# EAGLE design SCFschem (EAGLE 8.7.1)
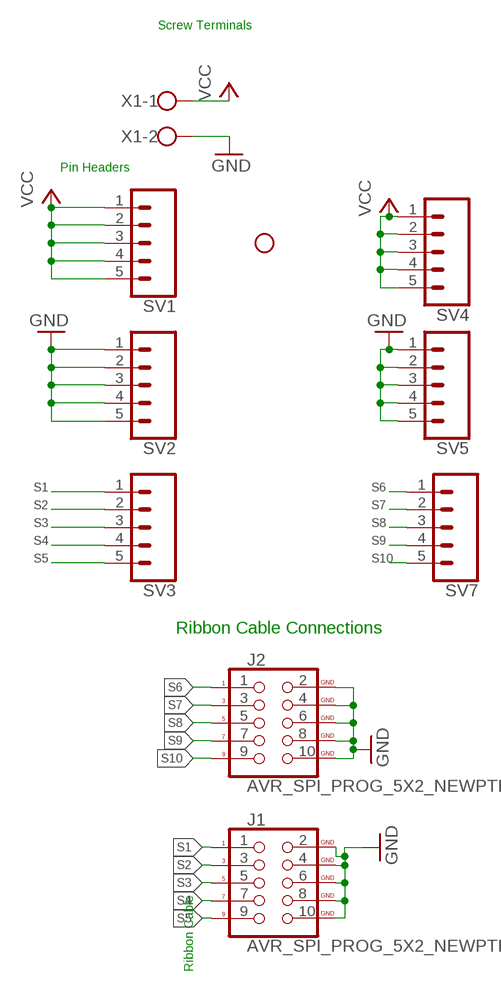
[diagram p0: schematic, sheet 1]

## Parts
H1  STAND-OFF  [STAND-OFF]
J1  AVR_SPI_PROG_5X2_NEWPTH2  [2X5-SHROUDED]
J2  AVR_SPI_PROG_5X2_NEWPTH2  [2X5-SHROUDED]
SV1  CONN_05  [1X05]
SV2  CONN_05  [1X05]
SV3  CONN_05  [1X05]
SV4  CONN_05  [1X05]
SV5  CONN_05  [1X05]
SV7  CONN_05  [1X05]
X1  1X02_5MM_SCREW  [W237-102]

## Nets
GND: J1.2(GND) J1.4(GND) J1.6(GND) J1.8(GND) J1.10(GND) J2.2(GND) J2.4(GND) J2.6(GND) J2.8(GND) J2.10(GND) SV2.1 SV2.2 SV2.3 SV2.4 SV2.5 SV5.1 SV5.2 SV5.3 SV5.4 SV5.5 X1.2
S1: J1.1 SV3.1
S2: J1.3 SV3.2
S3: J1.5 SV3.3
S4: J1.7 SV3.4
S5: J1.9 SV3.5
S6: J2.1 SV7.1
S7: J2.3 SV7.2
S8: J2.5 SV7.3
S9: J2.7 SV7.4
S10: J2.9 SV7.5
VCC: SV1.1 SV1.2 SV1.3 SV1.4 SV1.5 SV4.1 SV4.2 SV4.3 SV4.4 SV4.5 X1.1

## Notes on the sheet
- Screw Terminals
- Pin Headers
- Ribbon Cable Connections
- Ribbon Cable

## Library data of the parts
H1 = SparkFun-Hardware:STAND-OFF: Stand Off Drill holes for mechanically mounting via screws, standoffs, etc. Note: Use the keepout ring to avoid running the screw head into surrounding components. Variant Overviews STAND-OFF - Mechanical footprint for a #4 phillips button head screw. STAND-OFF-TIGHT - Mechanical footprint for a #4 phillips button head screw, Example SparkFun Products Screw - Phillips Head (1/4", 4-40, 10 pack) <https://www.sparkfun.com/products/10453> (PRT-10453) Screw - Phillips Head (1/2", 4-40, 10 pack) <https://www.sparkfun.com/products/10452> (PRT-10452) Screw - Phillips Head (3/4", 4-40, 10 pack) <https://www.sparkfun.com/products/10451> (PRT-10451) Screw - Phillips Head (1", 4-40, 10 pack) <https://www.sparkfun.com/products/10450> (PRT-10450)
J1 J2 = SparkFun-Connectors:AVR_SPI_PROG_5X2_NEW: AVR 10-pin ICSP Header This is the standard AVR In Circuit Serial Programming header. Minimal, but includes pin one indicator. Works with standard Olimex programmers. SparkFun Products: 2x5 AVR ICSP Male Header <https://www.sparkfun.com/products/778> - PTH 2x5 Pin Shrouded Header <https://www.sparkfun.com/products/8506> - PTH2; PROD_ID: CONN-08671; SF_ID: PRT-08506
SV1-SV5 SV7 = SparkFun-Connectors:CONN_05: Multi connection point. Often used as Generic Header-pin footprint for 0.1 inch spaced/style header connections On any of the 0.1 inch spaced packages, you can populate with these: Break Away Headers - Straight <https://www.sparkfun.com/products/116> (PRT-00116) Break Away Male Headers - Right Angle <https://www.sparkfun.com/products/553> (PRT-00553) Female Headers <https://www.sparkfun.com/products/115> (PRT-00115) Break Away Headers - Machine Pin <https://www.sparkfun.com/products/117> (PRT-00117) Break Away Female Headers - Swiss Machine Pin <https://www.sparkfun.com/products/743> (PRT-00743) For SCREWTERMINALS and SPRING TERMINALS visit here: Screw Terimnals on SparkFun.com <https://www.sparkfun.com/search/results?term=Screw+Terminals> (5mm/3.5mm/2.54mm spacing) This device is also useful as a general connection point to wire up your design to another part of your project. Our various solder wires solder well into these plated through hole pads. Hook-Up Wire - Assortment (Stranded, 22 AWG) <https://www.sparkfun.com/products/11375> (PRT-11375) Hook-Up Wire - Assortment (Solid Core, 22 AWG) <https://www.sparkfun.com/products/11367> (PRT-11367) View the entire wire category on our website here <https://www.sparkfun.com/categories/141> Special notes: Molex polarized connector foot print use with SKU : PRT-08231 with associated crimp pins and housings. 1MM SMD Version SKU: PRT-10208
X1 = ECE388:1X02_5MM_SCREW: WAGO SCREW CLAMP; MPN: 237-102; OC_FARNELL: unknown; OC_NEWARK: 70K9898

## Board
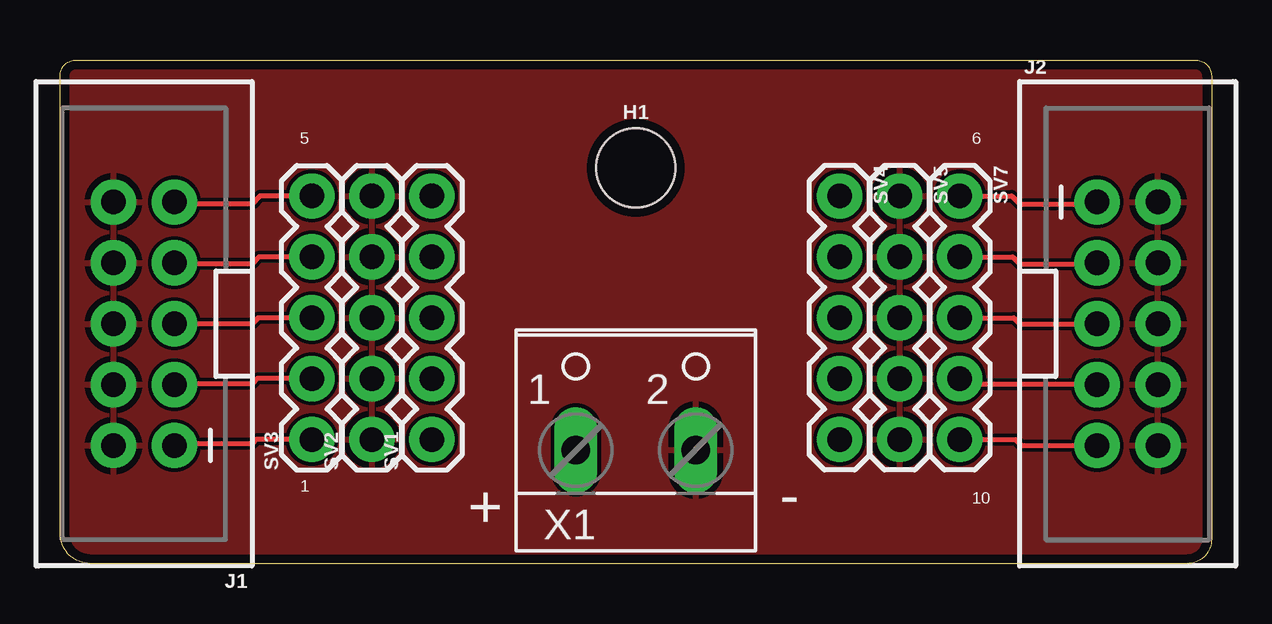
[diagram p1: board, top side]
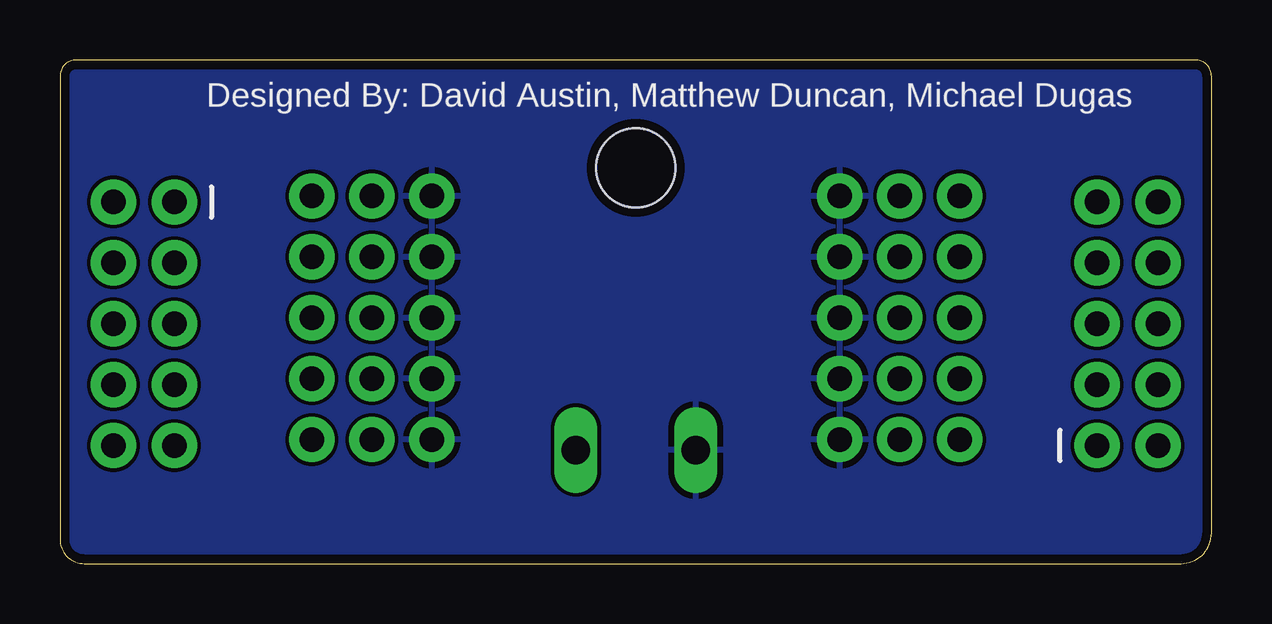
[diagram p2: board, bottom side, seen from below]

Size 48 x 21 mm. Coordinates in mm from the lower left corner, seen from the top.
Outline: 0.68,21 47.32,21 arc-90 48,20.32 48,1.01 arc-90 46.99,0 1.27,0 arc-90 0,1.27 0,20.32 arc-90 0.68,21
Copper layers (1*16): Top 0.035559375mm / dielectric 1.6mm / Bottom 0.035559375mm
Design rules "oshpark-2layer": minimum track width 6mil, minimum drill 10mil, track to track 6mil, track to pad 6mil, pad to pad 6mil, via to via 6mil, smd to smd 6mil, copper to edge 15mil, drill to drill 6mil, minimum pad ring 5mil, minimum via ring 5mil, stop-mask expansion 2.5mil, vias tented up to drill 0mil, thermal gap 10mil

### Footprints (pad centres in the part's own frame; a part is rotated, then mirrored left to right if it is on the bottom)
STAND-OFF = hole 3.302: 0,0
2X5-SHROUDED = drill 1.016 pad 1.88: 1 -1.27,5.08; 2 1.27,5.08; 3 -1.27,2.54; 4 1.27,2.54; 5 -1.27,0; 6 1.27,0; 7 -1.27,-2.54; 8 1.27,-2.54; 9 -1.27,-5.08; 10 1.27,-5.08
1X05 = drill 1.016 pad 1.88: 1 0,0; 2 2.54,0; 3 5.08,0; 4 7.62,0; 5 10.16,0
W237-102 = drill 1.194 long: 1 -2.5,-1.27; 2 2.5,-1.27

### Placement (x,y rotation side)
H1  24,16.5 0 top
J1  3.5,10 180 top
J2  44.5,10 0 top
SV1  15.5,5.17 90 top
SV2  13,5.17 90 top
SV3  10.5,5.17 90 top
SV4  32.5,15.33 270 top
SV5  35,15.33 270 top
SV7  37.5,15.33 270 top
X1  24,6 0 top

### Tracks (layer width: path | path; a pad name or v marks a point on that pad's centre or on a via)
GND
  pour Top: 0,21 48,21 48.26,0 0,0
S1
  Top 0.203: J1.1 4.85,5 8,5 8.17,5.17 SV3.1
S2
  Top 0.203: J1.3 4.85,7.54 4.89,7.5 8,7.5 8.21,7.71 SV3.2
S3
  Top 0.203: 4.85,10.08 J1.5 8,10 8.25,10.25 SV3.3
S4
  Top 0.203: J1.7 4.85,12.62 4.97,12.5 8,12.5 8.29,12.79 SV3.4
S5
  Top 0.203: 9.92,15.08 SV3.5 8.33,15.33 8,15 4.85,15 J1.9
S6
  Top 0.203: SV7.1 39.67,15.33 40,15 43.15,15 J2.1
S7
  Top 0.203: SV7.2 39.71,12.79 40,12.5 43.19,12.5 J2.3
S8
  Top 0.203: SV7.3 39.75,10.25 40,10 J2.5
S9
  Top 0.203: SV7.4 37.71,7.5 43.19,7.5 J2.7
S10
  Top 0.203: SV7.5 39.83,5.17 40.08,4.92 J2.9
VCC
  pour Bottom: 0,0 0,21 48,21 48.26,0

### Text on the board
tPlace: 5 | 6 | 1 | + | - | 10
bPlace: Designed By: David Austin, Matthew Duncan, Michael Dugas